# Altium schematic sheet Power.SchDoc
size A
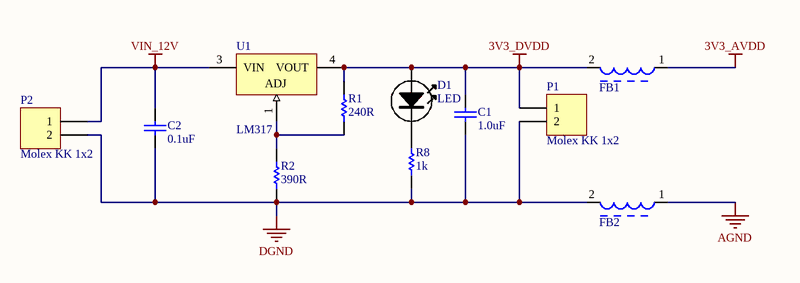
[diagram p0: Power.SchDoc]

## Parts
C1  1.0uF  [C0805]
C2  0.1uF  [C0805]
D1  LED  [0805LED]
FB1  FERRITE  [R0805]  (value not drawn)
FB2  FERRITE  [R0805]  (value not drawn)
P1  Molex KK 1x2  [Molex KK 2x1]
P2  Molex KK 1x2  [Molex KK 2x1]
R1  240R  [R0805]
R2  390R  [R0805]
R8  1k  [R0805]
U1  LM317  [D-PAK]

## Nets
3V3_AVDD: FB1.1
3V3_DVDD: C1.1 D1.A FB1.2 P1.1 R1.2 U1.4(VOUT)
AGND: FB2.1
DGND: C1.2 C2.2 FB2.2 P1.2 P2.2 R2.1 R8.1
VIN_12V: C2.1 P2.1 U1.3(VIN)
NetD1_K: D1.K R8.2
NetR1_1: R1.1 R2.2 U1.1(ADJ)

## Library data of the parts
C1 C2 = C0805: 0805 Capacitor
  C1: Value: 1.0uF
  C2: Value: 0.1uF
D1 = LED: Manufacturer: OSRAM Opto Semiconductors Inc; Manufacturer Part Number: LS T676-Q1R2-1-Z; Reel: D13
FB1 FB2 = FERRITE: FERRITE BEAD 0805
P1 P2 = Molex KK 1x2: 1x2 Molex KK Connector
R1 R2 R8 = R0805: RESISTOR 0805
  R1: Value: 240R
  R2: Value: 390R
  R8: Value: 1k
U1 = LM317: Linear Voltage Regulator